# EAGLE schematic sha2017_rev0_1_dev Kopie (EAGLE 6.6.0)
Assembly variants: PRODUCTION

## Sheet 1 of 3
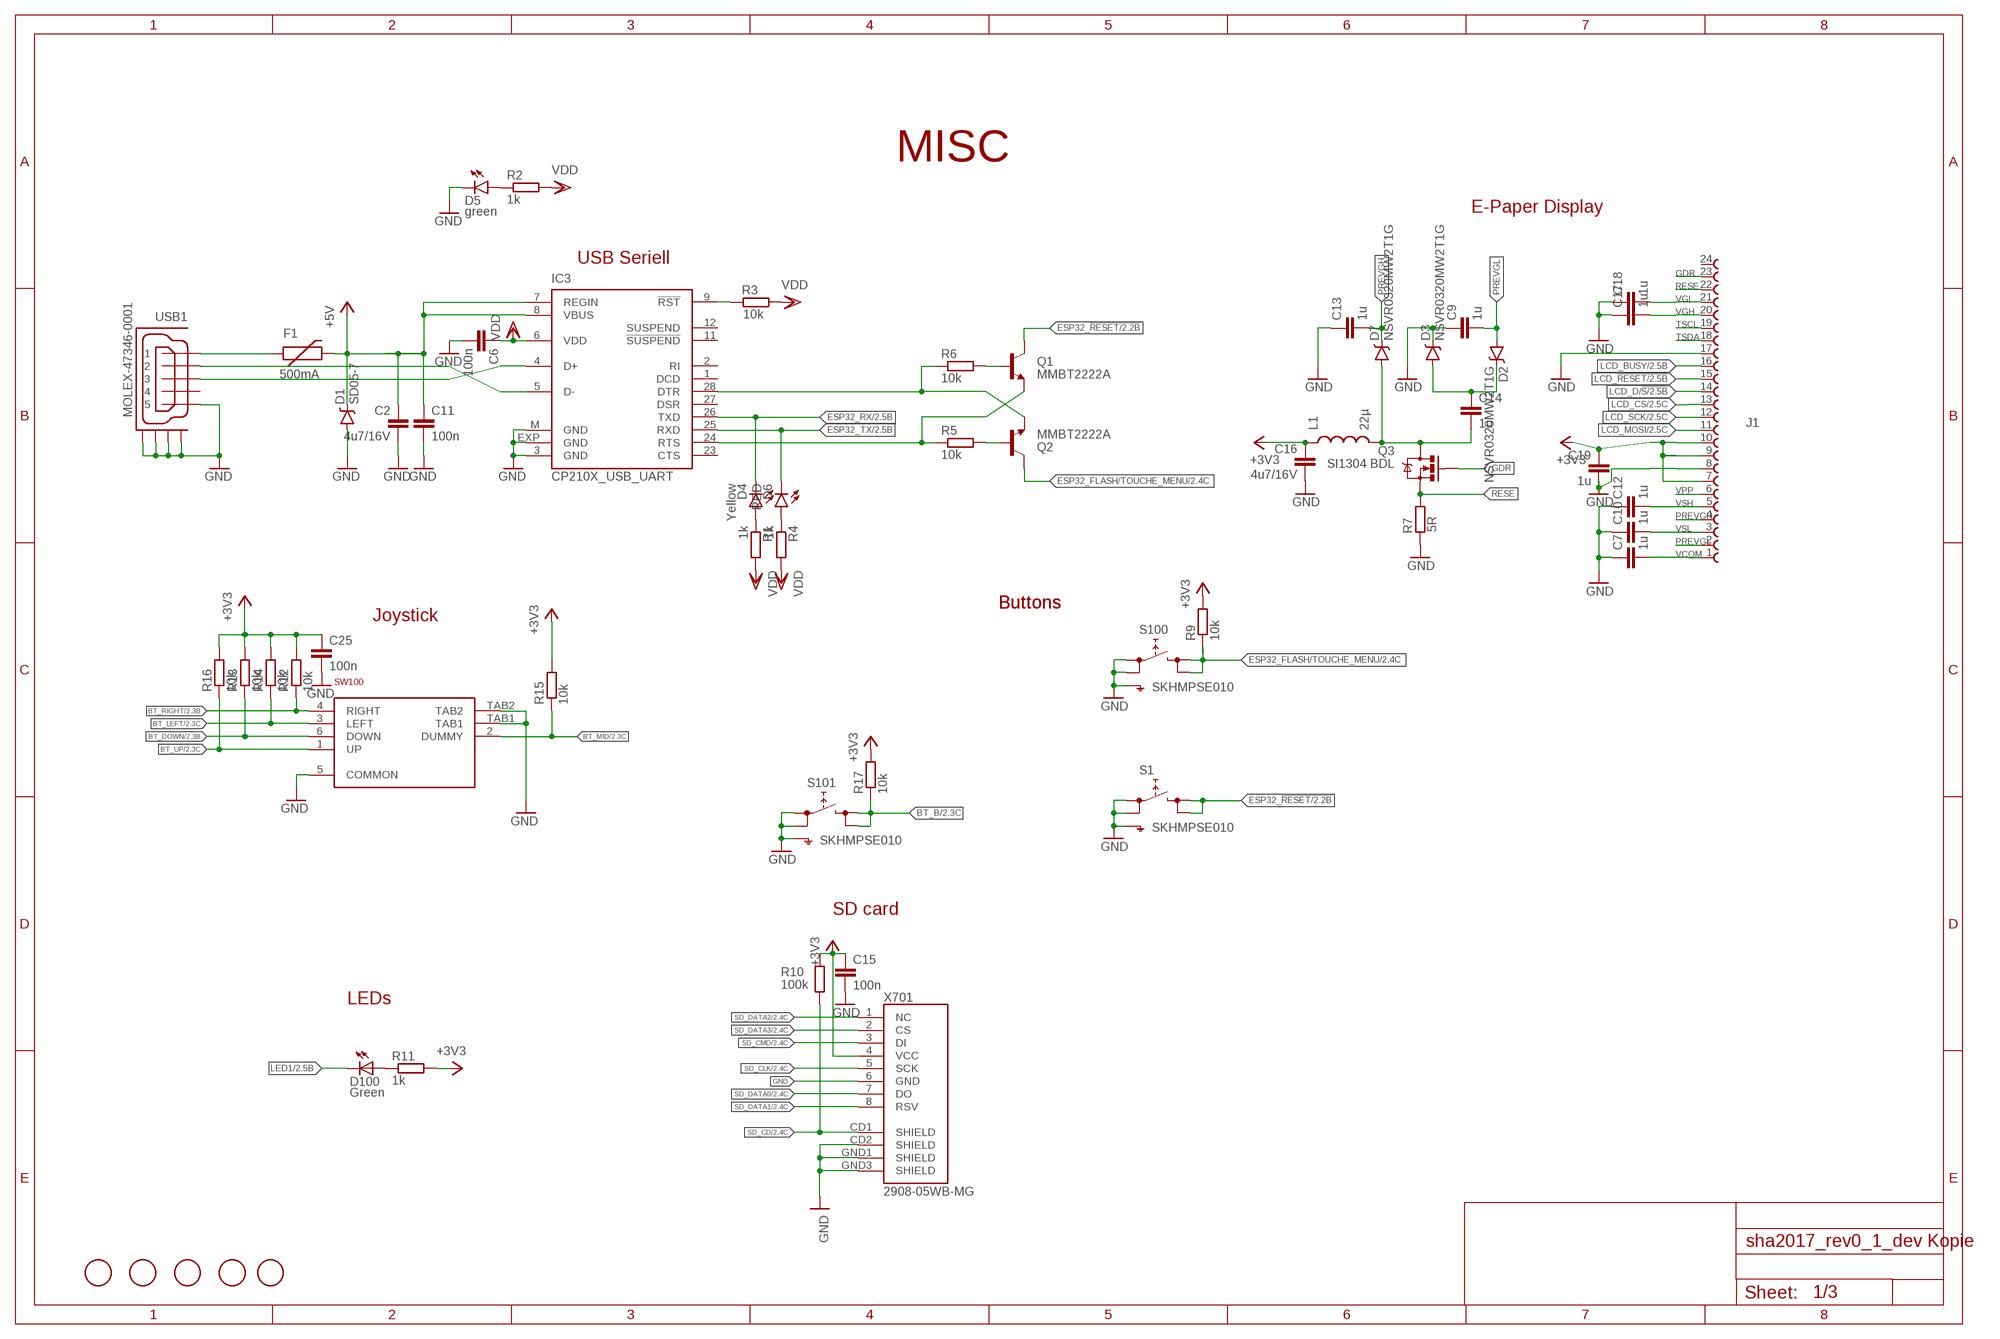
[diagram p0: schematic, sheet 1]

### Parts
C2  4u7/16V  C-EUC0805  [C0805]
C6  100n  C-EUC0603  [C0603]
C7  1u  C-EUC0603  [C0603]
C9  1u  C-EUC0603  [C0603]
C10  1u  C-EUC0603  [C0603]
C11  100n  C-EUC0603  [C0603]
C12  1u  C-EUC0603  [C0603]
C13  1u  C-EUC0603  [C0603]
C14  1u  C-EUC0603  [C0603]
C15  100n  C-EUC0603  [C0603]
C16  4u7/16V  C-EUC0805  [C0805]
C17  1u  C-EUC0603  [C0603]
C18  1u  C-EUC0603  [C0603]
C19  1u  C-EUC0603  [C0603]
C25  100n  C-EUC0603  [C0603]
D1  SD05-7  DIODE-SCHOTTKY-PMEG4005EJ  [SOD-323]
D2  NSVR0320MW2T1G  BAT20JFILM  [SOD-323]
D3  NSVR0320MW2T1G  BAT20JFILM  [SOD-323]
D4  Yellow  LED0603  [LED-0603]
D5  green  LED0603  [LED-0603]
D6  RED  LED0603  [LED-0603]
D7  NSVR0320MW2T1G  BAT20JFILM  [SOD-323]
D100  Green  LEDSML1206  [SML1206]
F1  500mA  PTCSMD  [PTC-1206]
FD1  FIDUCIAL  [FIDUCIAL_1MM]
FD2  FIDUCIAL  [FIDUCIAL_1MM]
FD3  FIDUCIAL  [FIDUCIAL_1MM]
FD4  FIDUCIAL  [FIDUCIAL_1MM]
FD5  FIDUCIAL  [FIDUCIAL_1MM]
IC3  CP210X_USB_UART  [MLP28]
J1  68712414022  [68712414022]
L1  22µ  INDUCTOR1210  [1210]
Q1  MMBT2222A  TRANSISTOR_NPNMMBT2222A  [SOT23-3]
Q2  MMBT2222A  TRANSISTOR_NPNMMBT2222A  [SOT23-3]
Q3  SI1304 BDL  MOSFET-NCHANNEL2N7002PW  [SOT323]
R1  1k  R-EU_R0603  [R0603]
R2  1k  R-EU_R0603  [R0603]
R3  10k  R-EU_R0603  [R0603]
R4  1k  R-EU_R0603  [R0603]
R5  10k  R-EU_R0603  [R0603]
R6  10k  R-EU_R0603  [R0603]
R7  5R  R0603-DASHES  [R0603-DASHES]
R9  10k  R-EU_R0603  [R0603]
R10  100k  R-EU_R0603  [R0603]
R11  1k  R-EU_R0603  [R0603]
R12  10k  R-EU_R0603  [R0603]
R13  10k  R-EU_R0603  [R0603]
R14  10k  R-EU_R0603  [R0603]
R15  10k  R-EU_R0603  [R0603]
R16  10k  R-EU_R0603  [R0603]
R17  10k  R-EU_R0603  [R0603]
S1  SKHMPSE010  [SKHMPXE010]
S100  SKHMPSE010  [SKHMPXE010]
S101  SKHMPSE010  [SKHMPXE010]
SW100  MCMT5-F-V  [MCMT5-F-V]
USB1  MOLEX-47346-0001  [MOLEX-47364-0001]
X701  2908-05WB-MG  [MICRO-SD-SOCKET-PP]  (not fitted in variant PRODUCTION)

### Nets
+3V3: C15.1 C16.1 C19.1 C25.1 J1.7 J1.9 J1.10 L1.1 R9.2 R10.1 R11.2 R12.2 R13.2 R14.2 R15.2 R16.2 R17.2 X701.4(VCC) ; also sheet 2,3
+5V [GND/3V3]: C2.1 C11.1 D1.C F1.2 IC3.7(REGIN) IC3.8(VBUS) ; also sheet 3
BT_B: R17.1 S101.3(2.1) S101.4(2.2) ; also sheet 2
BT_DOWN: R13.1 SW100.6(DOWN) ; also sheet 2
BT_LEFT: R14.1 SW100.3(LEFT) ; also sheet 2
BT_MID: R15.1 SW100.2(DUMMY) ; also sheet 2
BT_RIGHT: R12.1 SW100.4(RIGHT) ; also sheet 2
BT_UP: R16.1 SW100.1(UP) ; also sheet 2
ESP32_!RESET: Q1.3(C) S1.3(2.1) S1.4(2.2) ; also sheet 2
ESP32_FLASH/TOUCHE_MENU: Q2.3(C) R9.1 S100.3(2.1) S100.4(2.2) ; also sheet 2
ESP32_RX: D4.C IC3.26(TXD) ; also sheet 2
ESP32_TX: D6.C IC3.25(RXD) ; also sheet 2
GDR: J1.23 Q3.1(G)
GND: C2.2 C6.2 C7.1 C9.1 C10.1 C11.2 C12.1 C13.1 C15.2 C16.2 C17.1 C18.1 C19.2 C25.2 D1.A D3.C D5.C IC3.3(GND) IC3.EXP(GND) IC3.M(GND) J1.8 J1.17 R7.2 S1.1(1.1) S1.2(1.2) S1.5(SH) S100.1(1.1) S100.2(1.2) S100.5(SH) S101.1(1.1) S101.2(1.2) S101.5(SH) SW100.5(COMMON) SW100.TAB1 SW100.TAB2 USB1.5 USB1.GND1 USB1.GND2 USB1.GND3 USB1.GND4 X701.6(GND) X701.CD2(SHIELD) X701.GND1(SHIELD) X701.GND3(SHIELD) ; also sheet 2,3
LCD_!RESET: J1.15 ; also sheet 2
LCD_BUSY: J1.16 ; also sheet 2
LCD_CS: J1.13 ; also sheet 2
LCD_D/!S: J1.14 ; also sheet 2
LCD_MOSI: J1.11 ; also sheet 2
LCD_SCK: J1.12 ; also sheet 2
LED1: D100.C ; also sheet 2
N$8: IC3.9(!RST) R3.2
N$10: IC3.24(RTS) Q1.2(E) R5.1
N$11: IC3.28(DTR) Q2.2(E) R6.1
N$13: Q2.1(B) R5.2
N$14: Q1.1(B) R6.2
N$22: C14.1 D2.C D3.A
N$23: C14.2 D7.A L1.2 Q3.3(D)
N$25: D100.A R11.1
N$26: D5.A R2.1
N$27: D4.A R1.1
N$28: D6.A R4.1
N$32 [GND/3V3]: F1.1 USB1.1
PREVGH: C13.2 D7.C J1.4
PREVGL: C9.2 D2.A J1.2
RESE: J1.22 Q3.2(S) R7.1
SD_CD: R10.2 X701.CD1(SHIELD) ; also sheet 2
SD_CLK: X701.5(SCK) ; also sheet 2
SD_CMD: X701.3(DI) ; also sheet 2
SD_DATA0: X701.7(DO) ; also sheet 2
SD_DATA1: X701.8(RSV) ; also sheet 2
SD_DATA2: X701.1(NC) ; also sheet 2
SD_DATA3: X701.2(CS) ; also sheet 2
TSCL: J1.19
TSDA: J1.18
USB_DN_CON: IC3.5(D-) USB1.2
USB_DP_CON: IC3.4(D+) USB1.3
VCOM: C7.2 J1.1
VDD: C6.1 IC3.6(VDD) R1.2 R2.2 R3.1 R4.2
VGH: C17.2 J1.20
VGL: C18.2 J1.21
VPP: J1.6
VSH: C12.2 J1.5
VSL: C10.2 J1.3
Unconnected: IC3.1(DCD) IC3.2(RI) IC3.11(!SUSPEND) IC3.12(SUSPEND) IC3.23(CTS) IC3.27(DSR) J1.24 USB1.4

### Notes on the sheet
- MISC
- E-Paper Display
- USB Seriell
- Buttons | Buttons
- Joystick
- SD card
- LEDs

## Sheet 2 of 3
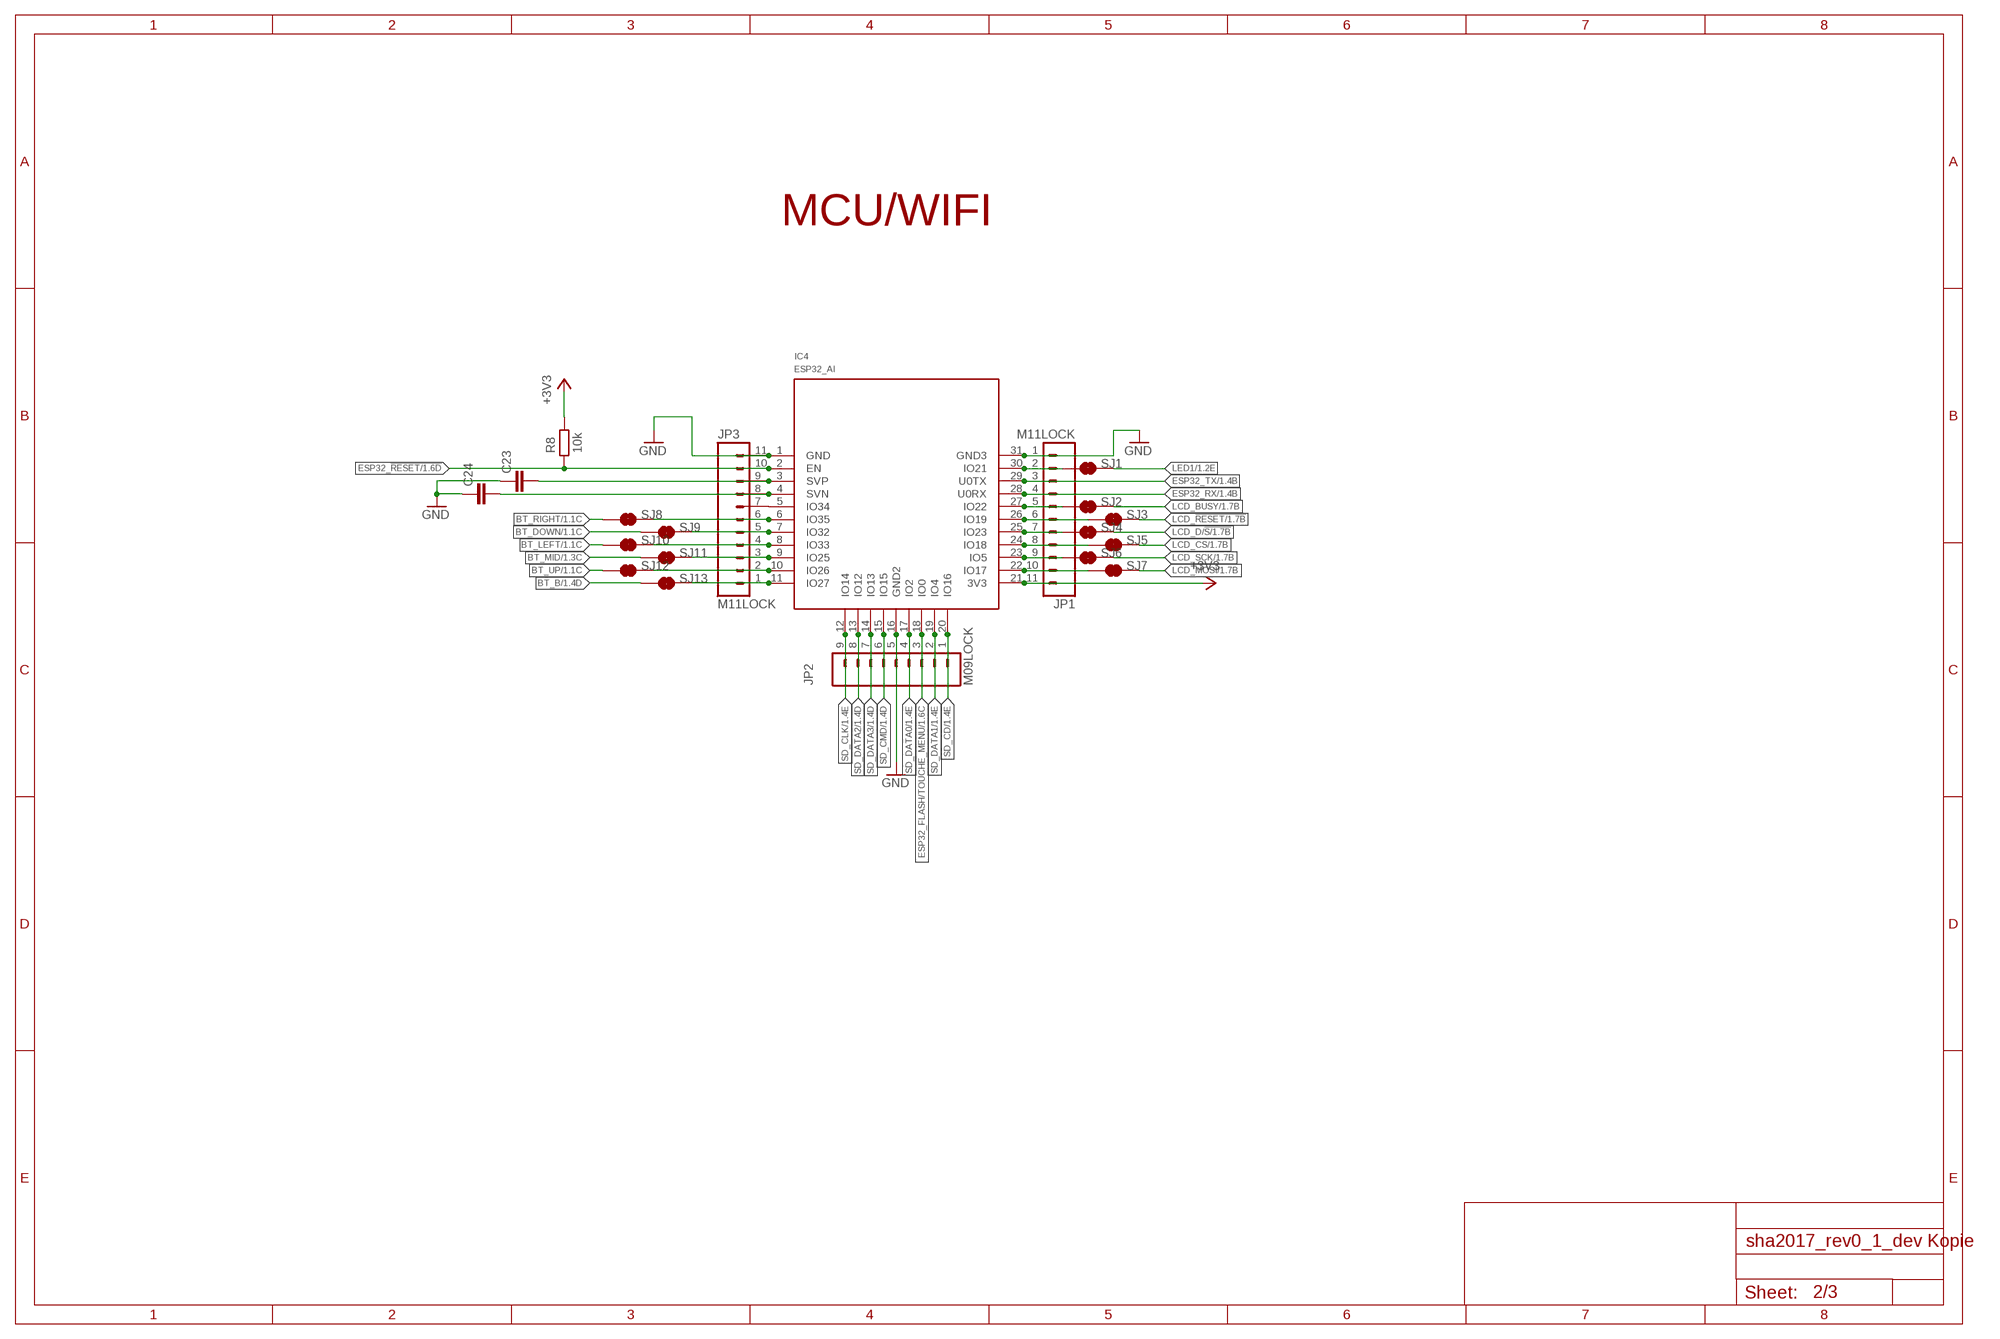
[diagram p1: schematic, sheet 2]

### Parts
C23  C-EUC0603  [C0603]
C24  C-EUC0603  [C0603]
IC4  ESP32_AI  [ESP32_AI]
JP1  M11LOCK  [1X11_LOCK]
JP2  M09LOCK  [1X09_LOCK]
JP3  M11LOCK  [1X11_LOCK]
R8  10k  R-EU_R0603  [R0603]
SJ1  JUMPER-PAD-2-NC_BY_TRACE  [PAD-JUMPER-2-NC_BY_TRACE_YES_SILK]
SJ2  JUMPER-PAD-2-NC_BY_TRACE  [PAD-JUMPER-2-NC_BY_TRACE_YES_SILK]
SJ3  JUMPER-PAD-2-NC_BY_TRACE  [PAD-JUMPER-2-NC_BY_TRACE_YES_SILK]
SJ4  JUMPER-PAD-2-NC_BY_TRACE  [PAD-JUMPER-2-NC_BY_TRACE_YES_SILK]
SJ5  JUMPER-PAD-2-NC_BY_TRACE  [PAD-JUMPER-2-NC_BY_TRACE_YES_SILK]
SJ6  JUMPER-PAD-2-NC_BY_TRACE  [PAD-JUMPER-2-NC_BY_TRACE_YES_SILK]
SJ7  JUMPER-PAD-2-NC_BY_TRACE  [PAD-JUMPER-2-NC_BY_TRACE_YES_SILK]
SJ8  JUMPER-PAD-2-NC_BY_TRACE  [PAD-JUMPER-2-NC_BY_TRACE_YES_SILK]
SJ9  JUMPER-PAD-2-NC_BY_TRACE  [PAD-JUMPER-2-NC_BY_TRACE_YES_SILK]
SJ10  JUMPER-PAD-2-NC_BY_TRACE  [PAD-JUMPER-2-NC_BY_TRACE_YES_SILK]
SJ11  JUMPER-PAD-2-NC_BY_TRACE  [PAD-JUMPER-2-NC_BY_TRACE_YES_SILK]
SJ12  JUMPER-PAD-2-NC_BY_TRACE  [PAD-JUMPER-2-NC_BY_TRACE_YES_SILK]
SJ13  JUMPER-PAD-2-NC_BY_TRACE  [PAD-JUMPER-2-NC_BY_TRACE_YES_SILK]

### Nets
+3V3: IC4.21(3V3) JP1.11 R8.1 ; also sheet 1,3
BT_B: SJ13.1 ; also sheet 1
BT_DOWN: SJ9.1 ; also sheet 1
BT_LEFT: SJ10.1 ; also sheet 1
BT_MID: SJ11.1 ; also sheet 1
BT_RIGHT: SJ8.1 ; also sheet 1
BT_UP: SJ12.1 ; also sheet 1
ESP32_!RESET: IC4.2(EN) JP3.10 R8.2 ; also sheet 1
ESP32_FLASH/TOUCHE_MENU: IC4.18(IO0) JP2.3 ; also sheet 1
ESP32_RX: IC4.28(U0RX) JP1.4 ; also sheet 1
ESP32_TX: IC4.29(U0TX) JP1.3 ; also sheet 1
GND: C23.1 C24.1 IC4.1(GND) IC4.16(GND2) IC4.31(GND3) JP1.1 JP2.5 JP3.11 ; also sheet 1,3
LCD_!RESET: SJ3.2 ; also sheet 1
LCD_BUSY: SJ2.2 ; also sheet 1
LCD_CS: SJ5.2 ; also sheet 1
LCD_D/!S: SJ4.2 ; also sheet 1
LCD_MOSI: SJ7.2 ; also sheet 1
LCD_SCK: SJ6.2 ; also sheet 1
LED1: SJ1.2 ; also sheet 1
N$1: C23.2 IC4.3(SVP) JP3.9
N$2: C24.2 IC4.4(SVN) JP3.8
N$3: IC4.11(IO27) JP3.1 SJ13.2
N$4: IC4.10(IO26) JP3.2 SJ12.2
N$6: IC4.9(IO25) JP3.3 SJ11.2
N$7: IC4.8(IO33) JP3.4 SJ10.2
N$9: IC4.7(IO32) JP3.5 SJ9.2
N$12: IC4.6(IO35) JP3.6 SJ8.2
N$15: IC4.5(IO34) JP3.7
N$16: IC4.30(IO21) JP1.2 SJ1.1
N$17: IC4.27(IO22) JP1.5 SJ2.1
N$18: IC4.25(IO23) JP1.7 SJ4.1
N$19: IC4.26(IO19) JP1.6 SJ3.1
N$20: IC4.24(IO18) JP1.8 SJ5.1
N$21: IC4.23(IO5) JP1.9 SJ6.1
N$24: IC4.22(IO17) JP1.10 SJ7.1
SD_CD: IC4.20(IO16) JP2.1 ; also sheet 1
SD_CLK: IC4.12(IO14) JP2.9 ; also sheet 1
SD_CMD: IC4.15(IO15) JP2.6 ; also sheet 1
SD_DATA0: IC4.17(IO2) JP2.4 ; also sheet 1
SD_DATA1: IC4.19(IO4) JP2.2 ; also sheet 1
SD_DATA2: IC4.13(IO12) JP2.8 ; also sheet 1
SD_DATA3: IC4.14(IO13) JP2.7 ; also sheet 1

### Notes on the sheet
- MCU/WIFI

## Sheet 3 of 3
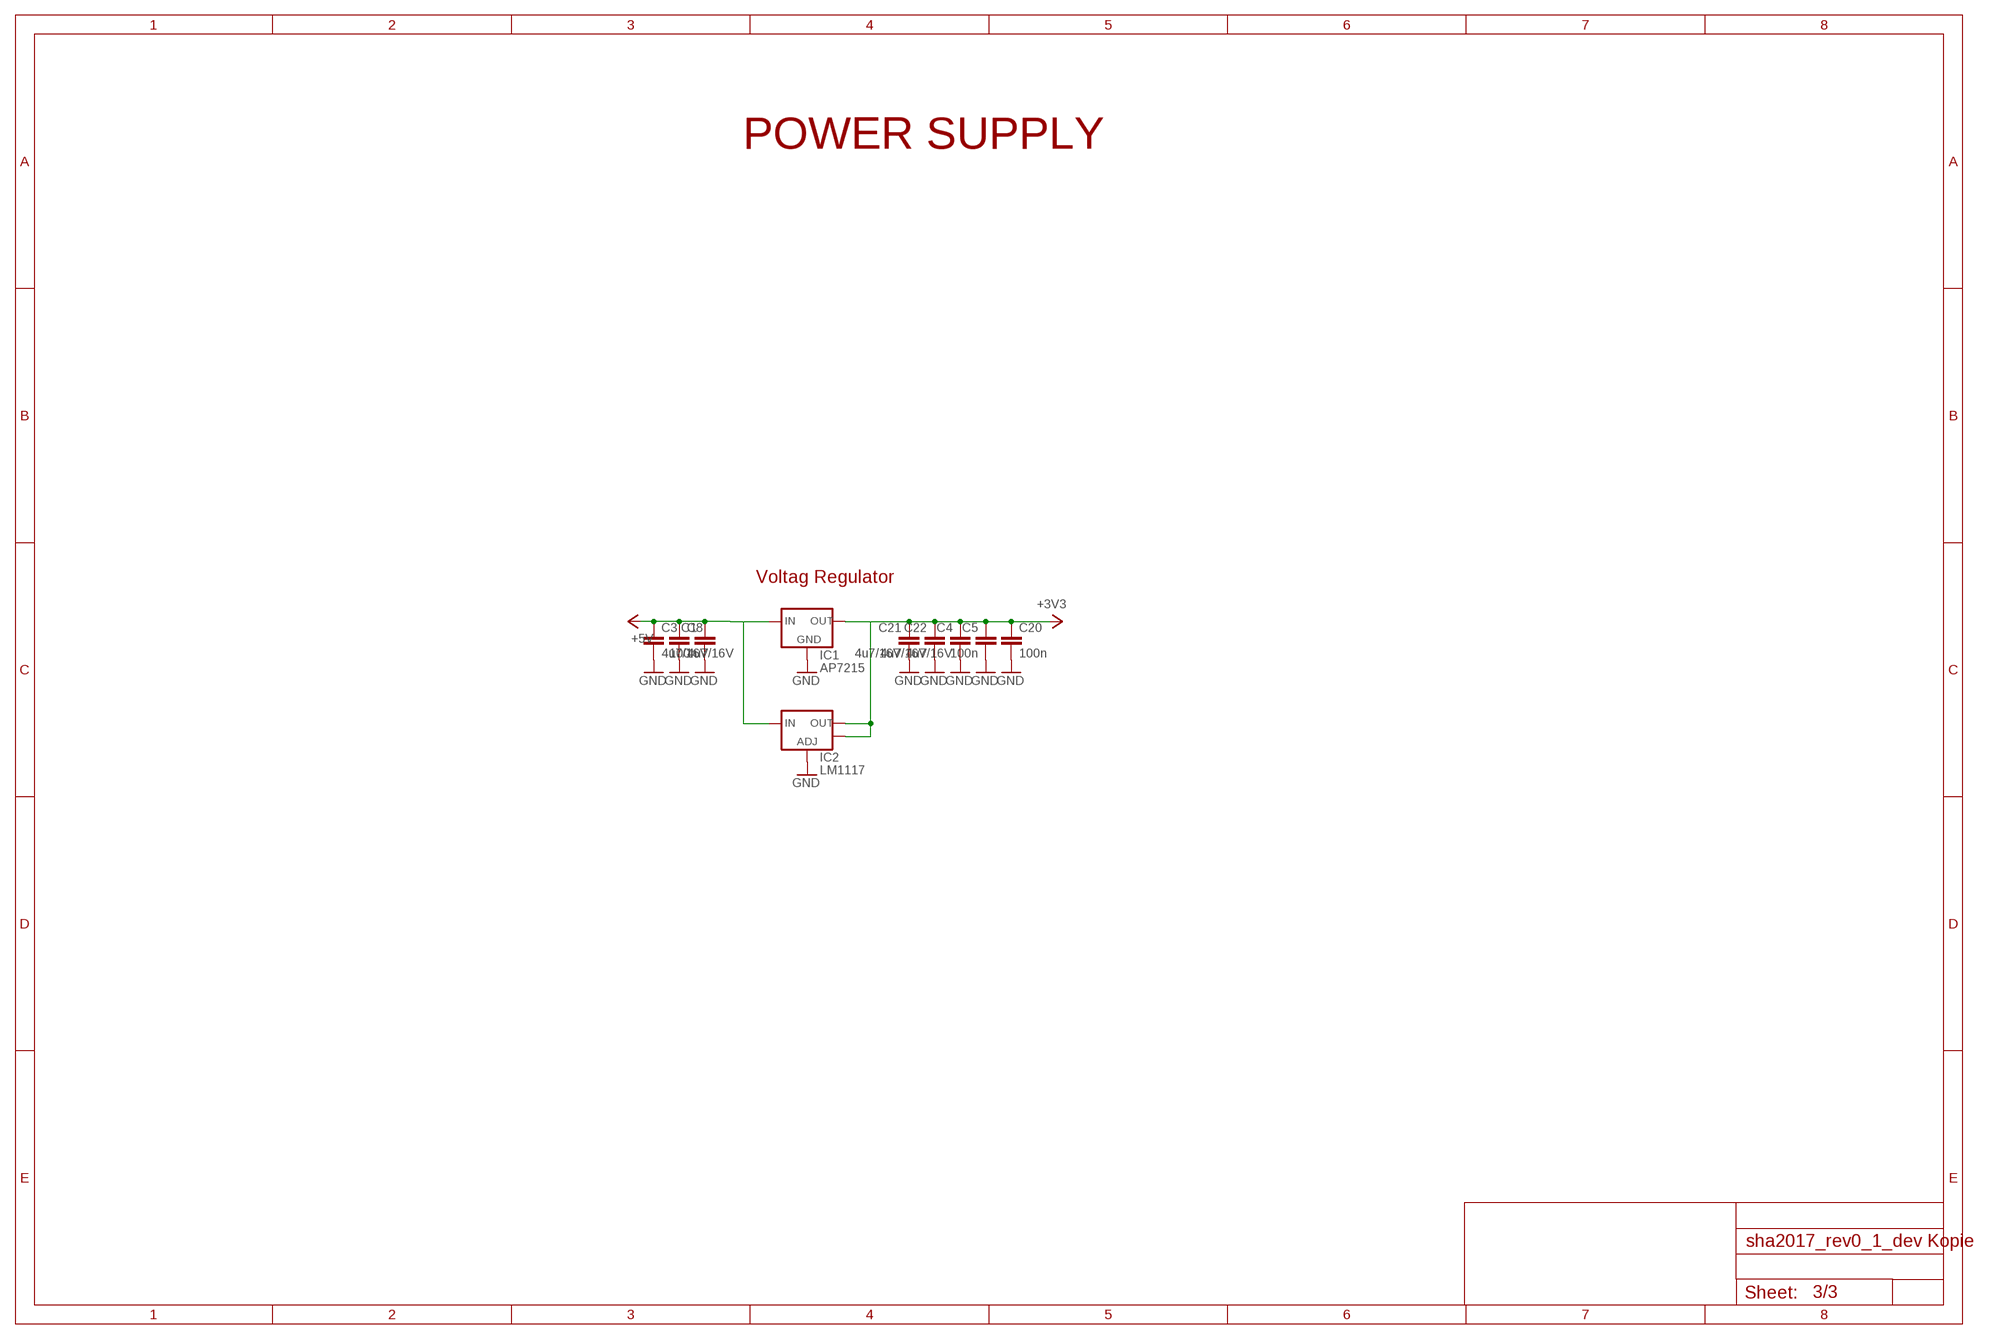
[diagram p2: schematic, sheet 3]

### Parts
C1  100n  C-EUC0603  [C0603]
C3  4u7/16V  C-EUC0805  [C0805]
C4  4u7/16V  C-EUC0805  [C0805]
C5  100n  C-EUC0603  [C0603]
C8  4u7/16V  C-EUC0805  [C0805]
C20  100n  C-EUC0603  [C0603]
C21  4u7/16V  C-EUC0805  [C0805]
C22  4u7/16V  C-EUC0805  [C0805]
IC1  AP7215  [SOT89]
IC2  LM1117  V_REG_LM1117SOT223  [SOT223]

### Nets
+3V3: C4.1 C5.1 C20.1 C21.1 C22.1 IC1.3(OUT) IC2.2(OUT) IC2.4(OUT) ; also sheet 1,2
+5V [GND/3V3]: C1.1 C3.1 C8.1 IC1.2(IN) IC1.2@(IN) IC2.3(IN) ; also sheet 1
GND: C1.2 C3.2 C4.2 C5.2 C8.2 C20.2 C21.2 C22.2 IC1.1(GND) IC2.1(ADJ) ; also sheet 1,2

### Notes on the sheet
- POWER SUPPLY
- Voltag Regulator

## Library data of the parts
C1 C5 C6 C11 C15 C20 C25 = rcl:C-EU: CAPACITOR, European symbol; PARTNO: GRM188R71H104KA93D
C2-C4 C8 C16 C21 C22 = rcl:C-EU: CAPACITOR, European symbol; PARTNO: GRM21BR61C475KA88K
C7 C9 C10 C12-C14 C17-C19 = rcl:C-EU: CAPACITOR, European symbol; PARTNO: GRM188R61E105KA12D
C23 C24 = rcl:C-EU: CAPACITOR, European symbol; OC_FARNELL: unknown
D1 = SparkFun-DiscreteSemi:DIODE-SCHOTTKY: Schottky diodes in SFE's production catalog BAT20J 1A 23V 0.62Vf RB751 120mA 40V 0.37Vf PMEG4005EJ 0.5A 40V 0.42Vf MBRA140 1A 40V 0.5Vf B340A 3A 40V SMA; PARTNO: PMEG4005EJ,115; PROD_ID: DIO-10955; VALUE: PMEG4005EJ
D2 D3 D7 = SparkFun-DiscreteSemi:BAT20JFILM: 23V, 1A Schottky diode, SOD-323 package; PARTNO: BAT20JFILM; PROD_ID: DIO-11623; VALUE: BAT20JFILM
D4-D6 = SparkFun-LED:LED: LEDs Standard schematic elements and footprints for 5mm, 3mm, 1206, and 0603 sized LEDs. 5mm - Spark Fun Electronics SKU : COM-00529 (and others)
D100 = led:LED: LED OSRAM: - CHIPLED LG R971, LG N971, LY N971, LG Q971, LY Q971, LO R971, LY R971 LH N974, LH R974 LS Q976, LO Q976, LY Q976 LO Q996 - Hyper CHIPLED LW Q18S LB Q993, LB Q99A, LB R99A - SideLED LS A670, LO A670, LY A670, LG A670, LP A670 LB A673, LV A673, LT A673, LW A673 LH A674 LY A675 LS A676, LA A676, LO A676, LY A676, LW A676 LS A679, LY A679, LG A679 - Hyper Micro SIDELED® LS Y876, LA Y876, LO Y876, LY Y876 LT Y87S - SmartLED LW L88C, LW L88S LB L89C, LB L89S, LG L890 LS L89K, LO L89K, LY L89K LS L896, LA L896, LO L896, LY L896 - TOPLED LS T670, LO T670, LY T670, LG T670, LP T670 LSG T670, LSP T670, LSY T670, LOP T670, LYG T670 LG T671, LOG T671, LSG T671 LB T673, LV T673, LT T673, LW T673 LH T674 LS T676, LA T676, LO T676, LY T676, LB T676, LH T676, LSB T676, LW T676 LB T67C, LV T67C, LT T67C, LS T67K, LO T67K, LY T67K, LW E67C LS E67B, LA E67B, LO E67B, LY E67B, LB E67C, LV E67C, LT E67C LW T67C LS T679, LY T679, LG T679 LS T770, LO T770, LY T770, LG T770, LP T770 LB T773, LV T773, LT T773, LW T773 LH T774 LS E675, LA E675, LY E675, LS T675 LS T776, LA T776, LO T776, LY T776, LB T776 LHGB T686 LT T68C, LB T68C - Hyper Mini TOPLED® LB M676 - Mini TOPLED Santana® LG M470 LS M47K, LO M47K, LY M47K Source: http://www.osram.convergy.de LUXEON: - LUMILED® LXK2-PW12-R00, LXK2-PW12-S00, LXK2-PW14-U00, LXK2-PW14-V00 LXK2-PM12-R00, LXK2-PM12-S00, LXK2-PM14-U00 LXK2-PE12-Q00, LXK2-PE12-R00, LXK2-PE12-S00, LXK2-PE14-T00, LXK2-PE14-U00 LXK2-PB12-K00, LXK2-PB12-L00, LXK2-PB12-M00, LXK2-PB14-N00, LXK2-PB14-P00, LXK2-PB14-Q00 LXK2-PR12-L00, LXK2-PR12-M00, LXK2-PR14-Q00, LXK2-PR14-R00 LXK2-PD12-Q00, LXK2-PD12-R00, LXK2-PD12-S00 LXK2-PH12-R00, LXK2-PH12-S00 LXK2-PL12-P00, LXK2-PL12-Q00, LXK2-PL12-R00 Source: www.luxeon.com KINGBRIGHT: KA-3528ASYC Source: www.kingbright.com; PARTNO: 156120VS75300
F1 = SparkFun-PowerIC:PTC: Resettable Fuse PTC Resettable Fuse. Spark Fun Electronics SKU : COM-08357; PARTNO: 0ZCJ0025FF2E; PROD_ID: RES-11150
FD1-FD5 = adafruit:FIDUCIAL: For use by pick and place machines to calibrate the vision/machine, 1mm By microbuilder.eu; OC_FARNELL: unknown
IC1 = badge:AP7215; PARTNO: AP7215-33YG-13
IC2 = SparkFun-PowerIC:V_REG_LM1117: Voltage Regulator LM1117 Standard adjustable voltage regulator but in SMD form. Spark Fun Electronics SKU : COM-00595; PARTNO: LM1117MPX-3.3/NOPB; PROD_ID: VREG-08170
IC3 = SparkFun-DigitalIC:CP210X_USB_UART: Single-Chip USB to UART Bridge Source: www.silabs.com .. CP2101.pdf / cp2102.pdf. Spark Fun Electronics SKU : COM-00310; PARTNO: CP2102-GMR
IC4 = badge:ESP32_AI
J1 = EAGLE-FPC_CONNECTOR_AND_FFC_CAB-rev1:68712414022: WR-FPC 0.5mm SMT ZIF Horizontal Top Contact, 24 Pins=>Code : Con_FPC_ZIF_0.50_68712414022 <http://katalog.we-online.de/media/images/eican/Con_FPC_ZIF_0.50_6871xx14022_pf2.jpg> Details see: http://katalog.we-online.de/en/em/687_1xx_140_22 Created 2014-07-09, Karrer Zheng 2014 (C) Würth Elektronik; PARTNO: 68712414022
JP1 JP3 = SparkFun-Connectors:M11: Header 11 Standard 11-pin 0.1" header. Use with straight break away headers (SKU : PRT-00116), right angle break away headers (PRT-00553), swiss pins (PRT-00743), machine pins (PRT-00117), and female headers (PRT-00115).
JP2 = SparkFun-Connectors:M09: Header 9 Standard 9-pin 0.1" header. Use with straight break away headers (SKU : PRT-00116), right angle break away headers (PRT-00553), swiss pins (PRT-00743), machine pins (PRT-00117), and female headers (PRT-00115).
L1 = SparkFun-Passives:INDUCTOR: Inductors Basic Inductor/Choke - 0603 and 1206. Footprints are not proven and vary greatly between part numbers. SRN6045- 33uH, 20% 1.4A SDR0403-560KL - 56uH, 10%, 500mA RMS/740mA peak; PARTNO: NLCV32T-220K-EF
Q1 Q2 = SparkFun-DiscreteSemi:TRANSISTOR_NPN: Generic NPN BJT MMBT2222A - TRANS-08049 (SOT-23, 1A 40V) MPSA42 - TRANS-09116 (SOT-23, 500mA 300V) MMBT5088LT1G - TRANS-11160 (SOT-23, 50 mA 30V) BC547 - COM-08928 <http://www.sparkfun.com/products/8928> (TO-92 45V 100mA) (1.Collector 2.Base 3.Emitter) 2N3904 - COM-00521 <http://www.sparkfun.com/products/521> (TO-92 40V 200mA) (1.Emitter 2.Base 3.Collector) P2N2222A - COM-12852 <http://www.sparkfun.com/products/12852> (TO-92 40V 600mA) (1.Collector 2.Base 3.Emitter); PARTNO: BC817-25,215; PROD_ID: TRANS-08049
Q3 = SparkFun-DiscreteSemi:MOSFET-NCHANNEL: Common NMOSFET Parts MFG P/N Store ID Prod ID FDD8780 TRANS-09984 SI7820DN TRANS-11055 FDS6630A IC-08089 2N7002PW TRANS-11151 FQP30N06L COM-10213 TRANS-10060 BSS123LT1G TRANS-08345 BSS138 TRANS-00830 BS170 2N7000; PARTNO: SI1308EDL-T1-GE3; PROD_ID: TRANS-11151
R1 R2 R4 R11 = rcl:R-EU_: RESISTOR, European symbol; PARTNO: ERJ-3GEYJ102V
R3 R5 R6 R9 R12-R17 = rcl:R-EU_: RESISTOR, European symbol; PARTNO: ERJ-3GEYJ103V
R7 = 00ralf:R0603-DASHES; PARTNO: ERJ-3GEYJ5R1V
R8 = rcl:R-EU_: RESISTOR, European symbol; OC_FARNELL: unknown; PARTNO: ERJ-3GEYJ103V
R10 = rcl:R-EU_: RESISTOR, European symbol; PARTNO: CRCW0603100KFKEA
S1 S100 S101 = switch:SKHMP*E010: 6.2 X 6.5mm TACT Switch (SMD) Source: http://www3.alps.co.jp/WebObjects/catalog.woa/PDF/E/Switch/Tact/SKHM/SKHM.PDF; PARTNO: SKHMQME010
SJ1-SJ13 = SparkFun-Passives:JUMPER-PAD-2-NC_BY_TRACE
SW100 = badge:MCMT5-F-V; PARTNO: SKRHAAE010
USB1 = usb_con-update:MOLEX-47346-0001: MICRO USB B, BOTTOM MOUNT; PARTNO: 10118194-0001LF
X701 = con-3m:2908-: 3M Card Connector microSD Normal Polarisation, Push-Push, Surface-Mount, 2900 Series 2908-05WB-MG: Surface mount, right angle Supplier: DigiKey 3M5607CT-ND Source: http://solutions.3m.com/wps/portal/3M/en_US/FP/FireProtection/Products/ProductCatalog/?PC_7_RJH9U5230GE3E02LECFTDQ0R92_nid=GGFDLLB87CbeGKZPW31NMHgl; PARTNO: 2908-05WB-MG

## Net classes
1 FAT: width 0.2 mm, drill 0.4 mm
2 GND/3V3: width 0.2 mm, drill 0.4 mm